# Altium schematic sheet Power.SchDoc
size A4
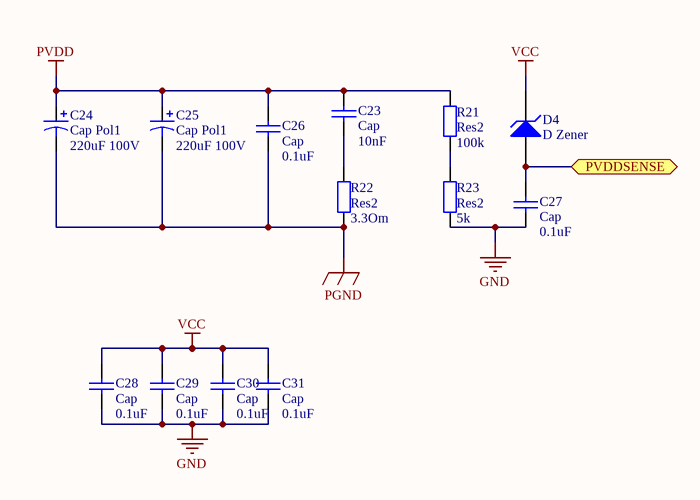
[diagram p0: Power.SchDoc]

## Parts
C23  Cap  value 10nF  [6-0805_N]
C24  Cap Pol1  value 220uF 100V  [RB7.6-15]
C25  Cap Pol1  value 220uF 100V  [RB7.6-15]
C26  Cap  value 0.1uF  [6-0805_N]
C27  Cap  value 0.1uF  [6-0805_N]
C28  Cap  value 0.1uF  [6-0805_N]
C29  Cap  value 0.1uF  [6-0805_N]
C30  Cap  value 0.1uF  [6-0805_N]
C31  Cap  value 0.1uF  [6-0805_N]
D4  D Zener  [SMB]
R21  Res2  value 100k  [6-0805_N]
R22  Res2  value 3.3Om  [6-0805_N]
R23  Res2  value 5k  [6-0805_N]

## Ports
PVDDSENSE

## Nets
GND: C27.1 C28.1 C29.1 C30.1 C31.1 R23.2
PGND: C24.2 C25.2 C26.1 R22.2
PVDD: C23.2 C24.1 C25.1 C26.2 R21.1
VCC: C28.2 C29.2 C30.2 C31.2 D4.2(K)
PVDDSENSE: C27.2 D4.1(A) ; port PVDDSENSE
NetC23_1: C23.1 R22.1
NetR21_2: R21.2 R23.1

## Library data of the parts
C23 C26-C31 = Cap: Capacitor; Published: 8-Jun-2000; LatestRevisionDate: 17-Jul-2002; LatestRevisionNote: Re-released for DXP Platform.; PackageReference: RAD-0.3; Publisher: Altium Limited; PackageDescription: Radial Cap, Thru-Hole; 2 Leads; 0.3 in Pin Spacing
C24 C25 = Cap Pol1: Polarized Capacitor (Radial); Published: 8-Jun-2000; LatestRevisionDate: 17-Jul-2002; LatestRevisionNote: Re-released for DXP Platform.; PackageReference: RB7.6-15; Publisher: Altium Limited; PackageDescription: Polarized Capacitor (Radial); 2 Leads
D4 = D Zener: Zener Diode; Published: 8-Jun-2000; LatestRevisionDate: 17-Jul-2002; LatestRevisionNote: Re-released for DXP Platform.; PackageReference: DIODE-0.7; Publisher: Altium Limited; PackageDescription: Diode, Thru-Hole; 2 Leads; 0.7 in Pin Spacing
R21-R23 = Res2: Resistor; Published: 8-Jun-2000; LatestRevisionDate: 17-Jul-2002; LatestRevisionNote: Re-released for DXP Platform.; PackageReference: AXIAL-0.4; Publisher: Altium Limited; PackageDescription: Axial Device, Thru-Hole; 2 Leads; 0.4 in Pin Spacing